# Altium schematic sheet FPGADecoupling.SchDoc
size A4; SheetNumber: 2; SheetTotal: 10
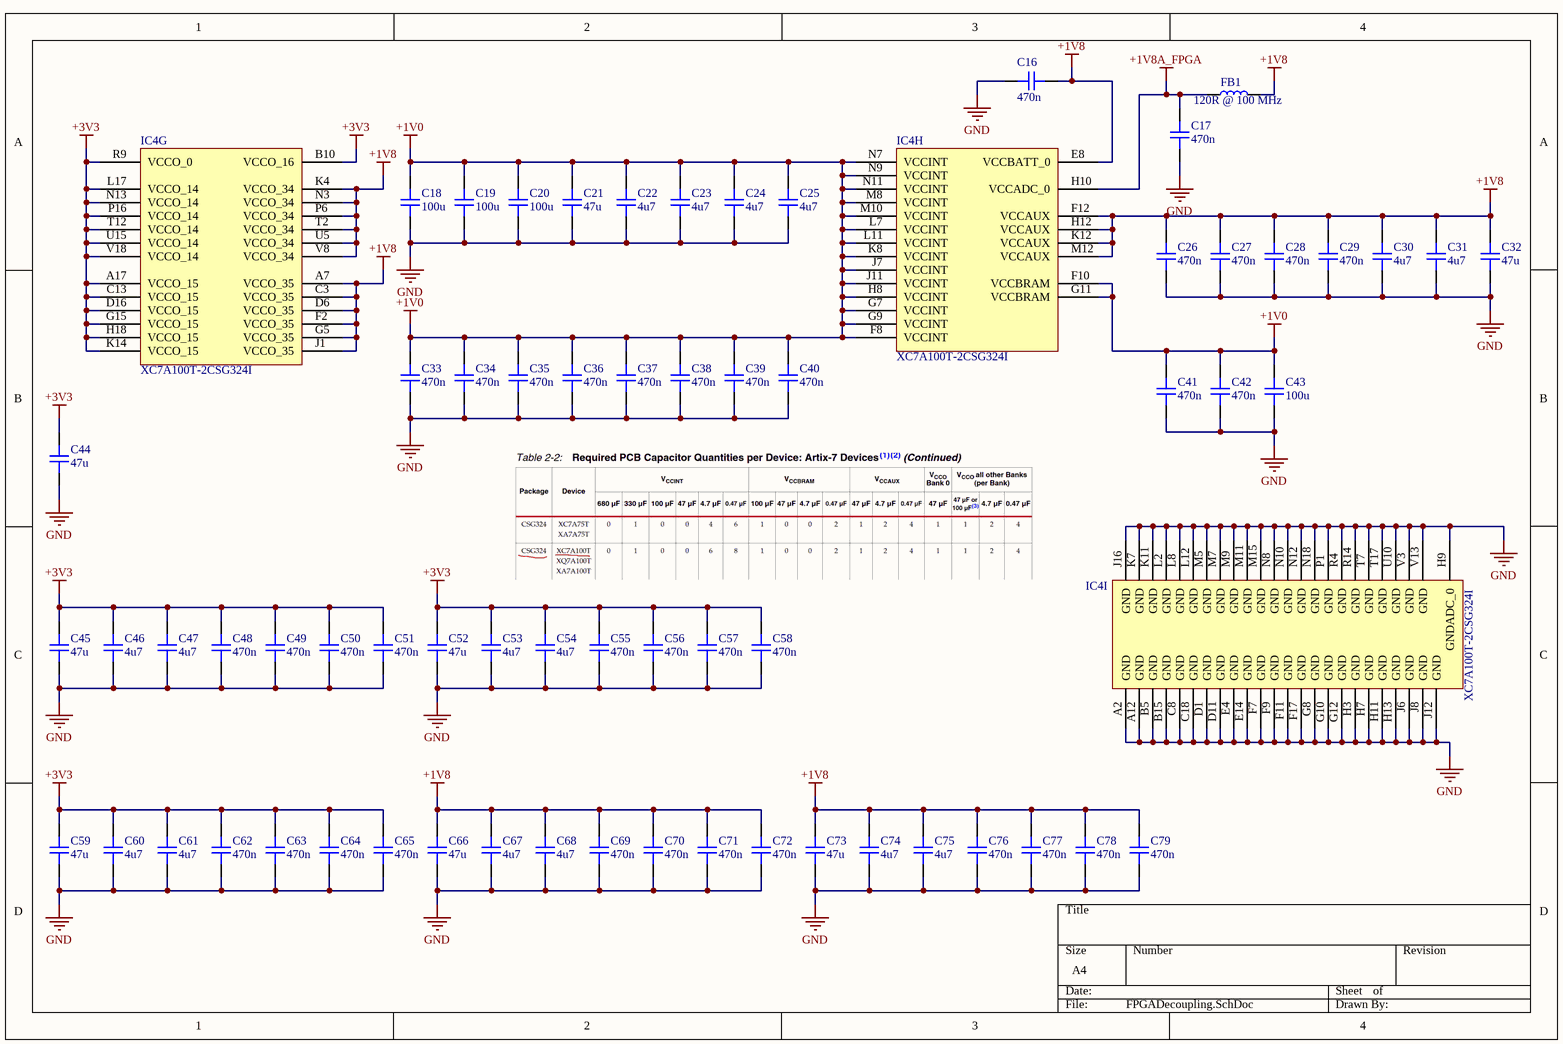
[diagram p0: FPGADecoupling.SchDoc]

## Parts
C16  470n  [CAP_0201]
C17  470n  [CAP_0201]
C18  100u  [CAP_0805]
C19  100u  [CAP_0805]
C20  100u  [CAP_0805]
C21  47u  [CAP_0603]
C22  4u7  [CAP_0402]
C23  4u7  [CAP_0402]
C24  4u7  [CAP_0402]
C25  4u7  [CAP_0402]
C26  470n  [CAP_0201]
C27  470n  [CAP_0201]
C28  470n  [CAP_0201]
C29  470n  [CAP_0201]
C30  4u7  [CAP_0402]
C31  4u7  [CAP_0402]
C32  47u  [CAP_0603]
C33  470n  [CAP_0201]
C34  470n  [CAP_0201]
C35  470n  [CAP_0201]
C36  470n  [CAP_0201]
C37  470n  [CAP_0201]
C38  470n  [CAP_0201]
C39  470n  [CAP_0201]
C40  470n  [CAP_0201]
C41  470n  [CAP_0201]
C42  470n  [CAP_0201]
C43  100u  [CAP_0805]
C44  47u  [CAP_0603]
C45  47u  [CAP_0603]
C46  4u7  [CAP_0402]
C47  4u7  [CAP_0402]
C48  470n  [CAP_0201]
C49  470n  [CAP_0201]
C50  470n  [CAP_0201]
C51  470n  [CAP_0201]
C52  47u  [CAP_0603]
C53  4u7  [CAP_0402]
C54  4u7  [CAP_0402]
C55  470n  [CAP_0201]
C56  470n  [CAP_0201]
C57  470n  [CAP_0201]
C58  470n  [CAP_0201]
C59  47u  [CAP_0603]
C60  4u7  [CAP_0402]
C61  4u7  [CAP_0402]
C62  470n  [CAP_0201]
C63  470n  [CAP_0201]
C64  470n  [CAP_0201]
C65  470n  [CAP_0201]
C66  47u  [CAP_0603]
C67  4u7  [CAP_0402]
C68  4u7  [CAP_0402]
C69  470n  [CAP_0201]
C70  470n  [CAP_0201]
C71  470n  [CAP_0201]
C72  470n  [CAP_0201]
C73  47u  [CAP_0603]
C74  4u7  [CAP_0402]
C75  4u7  [CAP_0402]
C76  470n  [CAP_0201]
C77  470n  [CAP_0201]
C78  470n  [CAP_0201]
C79  470n  [CAP_0201]
FB1  120R @ 100 MHz  [IND_0201]
IC4  XC7A100T-2CSG324I  [CSG324]  (parts G,H,I of 9)

## Nets
+1V0: C18.2 C19.2 C20.2 C21.2 C22.2 C23.2 C24.2 C25.2 C33.2 C34.2 C35.2 C36.2 C37.2 C38.2 C39.2 C40.2 C41.2 C42.2 C43.2 IC4.F8(VCCINT) IC4.F10(VCCBRAM) IC4.G7(VCCINT) IC4.G9(VCCINT) IC4.G11(VCCBRAM) IC4.H8(VCCINT) IC4.J7(VCCINT) IC4.J11(VCCINT) IC4.K8(VCCINT) IC4.L7(VCCINT) IC4.L11(VCCINT) IC4.M8(VCCINT) IC4.M10(VCCINT) IC4.N7(VCCINT) IC4.N9(VCCINT) IC4.N11(VCCINT)
+1V8: C16.2 C26.2 C27.2 C28.2 C29.2 C30.2 C31.2 C32.2 C66.2 C67.2 C68.2 C69.2 C70.2 C71.2 C72.2 C73.2 C74.2 C75.2 C76.2 C77.2 C78.2 C79.2 FB1.2 IC4.A7(VCCO_35) IC4.C3(VCCO_35) IC4.D6(VCCO_35) IC4.E8(VCCBATT_0) IC4.F2(VCCO_35) IC4.F12(VCCAUX) IC4.G5(VCCO_35) IC4.H12(VCCAUX) IC4.J1(VCCO_35) IC4.K4(VCCO_34) IC4.K12(VCCAUX) IC4.M12(VCCAUX) IC4.N3(VCCO_34) IC4.P6(VCCO_34) IC4.T2(VCCO_34) IC4.U5(VCCO_34) IC4.V8(VCCO_34)
+1V8A_FPGA: C17.2 FB1.1 IC4.H10(VCCADC_0)
+3V3: C44.2 C45.2 C46.2 C47.2 C48.2 C49.2 C50.2 C51.2 C52.2 C53.2 C54.2 C55.2 C56.2 C57.2 C58.2 C59.2 C60.2 C61.2 C62.2 C63.2 C64.2 C65.2 IC4.A17(VCCO_15) IC4.B10(VCCO_16) IC4.C13(VCCO_15) IC4.D16(VCCO_15) IC4.G15(VCCO_15) IC4.H18(VCCO_15) IC4.K14(VCCO_15) IC4.L17(VCCO_14) IC4.N13(VCCO_14) IC4.P16(VCCO_14) IC4.R9(VCCO_0) IC4.T12(VCCO_14) IC4.U15(VCCO_14) IC4.V18(VCCO_14)
GND: C16.1 C17.1 C18.1 C19.1 C20.1 C21.1 C22.1 C23.1 C24.1 C25.1 C26.1 C27.1 C28.1 C29.1 C30.1 C31.1 C32.1 C33.1 C34.1 C35.1 C36.1 C37.1 C38.1 C39.1 C40.1 C41.1 C42.1 C43.1 C44.1 C45.1 C46.1 C47.1 C48.1 C49.1 C50.1 C51.1 C52.1 C53.1 C54.1 C55.1 C56.1 C57.1 C58.1 C59.1 C60.1 C61.1 C62.1 C63.1 C64.1 C65.1 C66.1 C67.1 C68.1 C69.1 C70.1 C71.1 C72.1 C73.1 C74.1 C75.1 C76.1 C77.1 C78.1 C79.1 IC4.A2(GND) IC4.A12(GND) IC4.B5(GND) IC4.B15(GND) IC4.C8(GND) IC4.C18(GND) IC4.D1(GND) IC4.D11(GND) IC4.E4(GND) IC4.E14(GND) IC4.F7(GND) IC4.F9(GND) IC4.F11(GND) IC4.F17(GND) IC4.G8(GND) IC4.G10(GND) IC4.G12(GND) IC4.H3(GND) IC4.H7(GND) IC4.H9(GNDADC_0) IC4.H11(GND) IC4.H13(GND) IC4.J6(GND) IC4.J8(GND) IC4.J12(GND) IC4.J16(GND) IC4.K7(GND) IC4.K11(GND) IC4.L2(GND) IC4.L8(GND) IC4.L12(GND) IC4.M5(GND) IC4.M7(GND) IC4.M9(GND) IC4.M11(GND) IC4.M15(GND) IC4.N8(GND) IC4.N10(GND) IC4.N12(GND) IC4.N18(GND) IC4.P1(GND) IC4.R4(GND) IC4.R14(GND) IC4.T7(GND) IC4.T17(GND) IC4.U10(GND) IC4.V3(GND) IC4.V13(GND)

## Library data of the parts
C16 C17 C26-C29 C33-C42 C48-C51 C55-C58 C62-C65 C69-C72 C76-C79 = CAP_0201: Capacitor SMD 0201; Manufacturer: *; Manufacturer Part Number: *; Distributor Link: *; LCSC: *; Rating: *; Dielectric: *
C18-C20 C43 = CAP_0805: Capacitor SMD 0805; Manufacturer: *; Manufacturer Part Number: *; Distributor Link: *; LCSC: *; Rating: *; Dielectric: *
C21 C32 C44 C45 C52 C59 C66 C73 = CAP_0603: Capacitor SMD 0603; Manufacturer: *; Manufacturer Part Number: *; Distributor Link: *; LCSC: *; Rating: *; Dielectric: *
C22-C25 C30 C31 C46 C47 C53 C54 C60 C61 C67 C68 C74 C75 = CAP_0402: Capacitor SMD 0402; Manufacturer: *; Manufacturer Part Number: *; Distributor Link: *; LCSC: *; Rating: *; Dielectric: *
FB1 = IND_0201: Inductor SMD 0201; Manufacturer_Name: Murata Electronics; Manufacturer_Part_Number: LQP03HQ56NH02D; Datasheet Link: https://psearch.en.murata.com/inductor/product/LQP03HQ56NH02%23.html; Height: 0.42mm; Mouser Part Number: 81-LQP03HQ56NH02D; Mouser Price/Stock: https://www.mouser.co.uk/ProductDetail/Murata-Electronics/LQP03HQ56NH02D?qs=B6kkDfuK7%2FBQu1Ob9%2FT2Bg%3D%3D
IC4 = XC7A100T-2CSG324I: Artix-7 FPGA, 210 User I/Os, 0 GTP, 324-Ball BGA, Speed Grade 2, Industrial Grade, Pb-Free; Manufacturer: Xilinx; Logic Cells: 101440; DSP48E1 Slices: 240; Block RAM Blocks (Max Kb): 4860; Clock Mgmt Tiles (CMTs): 6; Max User I/O: 300; CLBs (Slices): 15850; Block RAM Blocks (18Kb): 270; Speed Grade: -2; Block RAM Blocks (36Kb): 135; ComponentLink1Description: Datasheet; ComponentLink3Description: DC and Switching Characteristics; Generic Part Number: XC7A100T; RoHS: Pb-Free; Mounting Technology: Surface Mount; PackageReference: CSG324; ComponentLink4URL: http://www.xilinx.com/support/packagefiles/a7packages/xc7a100tcsg324pkg.txt; NexusDeviceID: XC7A100T-2CSG324I; PackageVersion: Rev 1.8; PartNumber: XC7A100T-2CSG324I; CLBs (Max Distributed RAM Kb): 1188; Code_JEDEC: MO-275-KKAC-1; ComponentLink2Description: Package Specification; ComponentLink1URL: http://www.xilinx.com/support/documentation/data_sheets/ds180_7Series_Overview.pdf; ComponentLink3URL: http://www.xilinx.com/support/documentation/data_sheets/ds181_Artix_7_Data_Sheet.pdf; ComponentLink5URL: http://www.xilinx.com/support/documentation/user_guides/ug475_7Series_Pkg_Pinout.pdf; PackageDescription: Wire-Bond Chip-Scale BGA, Body 15 x 15 mm, 0.8 mm Pitch; ComponentLink4Description: Package File; DatasheetVersion: v1.12; ComponentLink2URL: http://www.xilinx.com/support/documentation/user_guides/ug475_7Series_Pkg_Pinout.pdf; ComponentLink5Description: Packaging and Pinout